# EAGLE design MOOG_AC2690_toSPI_Commutator_Board (EAGLE 8.3.2)
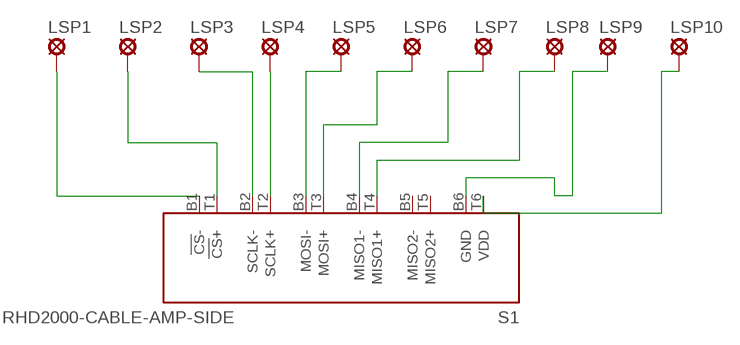
[diagram p0: schematic, sheet 1]

## Parts
LSP1  LSP11  [LSP11]
LSP2  LSP11  [LSP11]
LSP3  LSP11  [LSP11]
LSP4  LSP11  [LSP11]
LSP5  LSP11  [LSP11]
LSP6  LSP11  [LSP11]
LSP7  LSP11  [LSP11]
LSP8  LSP11  [LSP11]
LSP9  LSP11  [LSP11]
LSP10  LSP11  [LSP11]
S1  RHD2000-CABLE-AMP-SIDE  [OMNETICS_PZN-12-AA]

## Nets
N$12: LSP1.MP S1.B1(!CS!-)
N$13: LSP2.MP S1.T1(!CS!+)
N$14: LSP3.MP S1.B2(SCLK-)
N$15: LSP4.MP S1.T2(SCLK+)
N$16: LSP5.MP S1.B3(MOSI-)
N$17: LSP6.MP S1.T3(MOSI+)
N$18: LSP7.MP S1.B4(MISO1-)
N$19: LSP8.MP S1.T4(MISO1+)
N$20: LSP9.MP S1.B6(GND)
N$21: LSP10.MP S1.T6(VDD)
Unconnected: S1.B5(MISO2-) S1.T5(MISO2+)

## Library data of the parts
LSP1-LSP10 = solpad:LSP11: SOLDER PAD drill 1.1 mm
S1 = RHD2000:RHD2000-CABLE-AMP-SIDE: Omnetics A79623 PZN-12-AA connector for SPI interface (amplifier side)

## Board
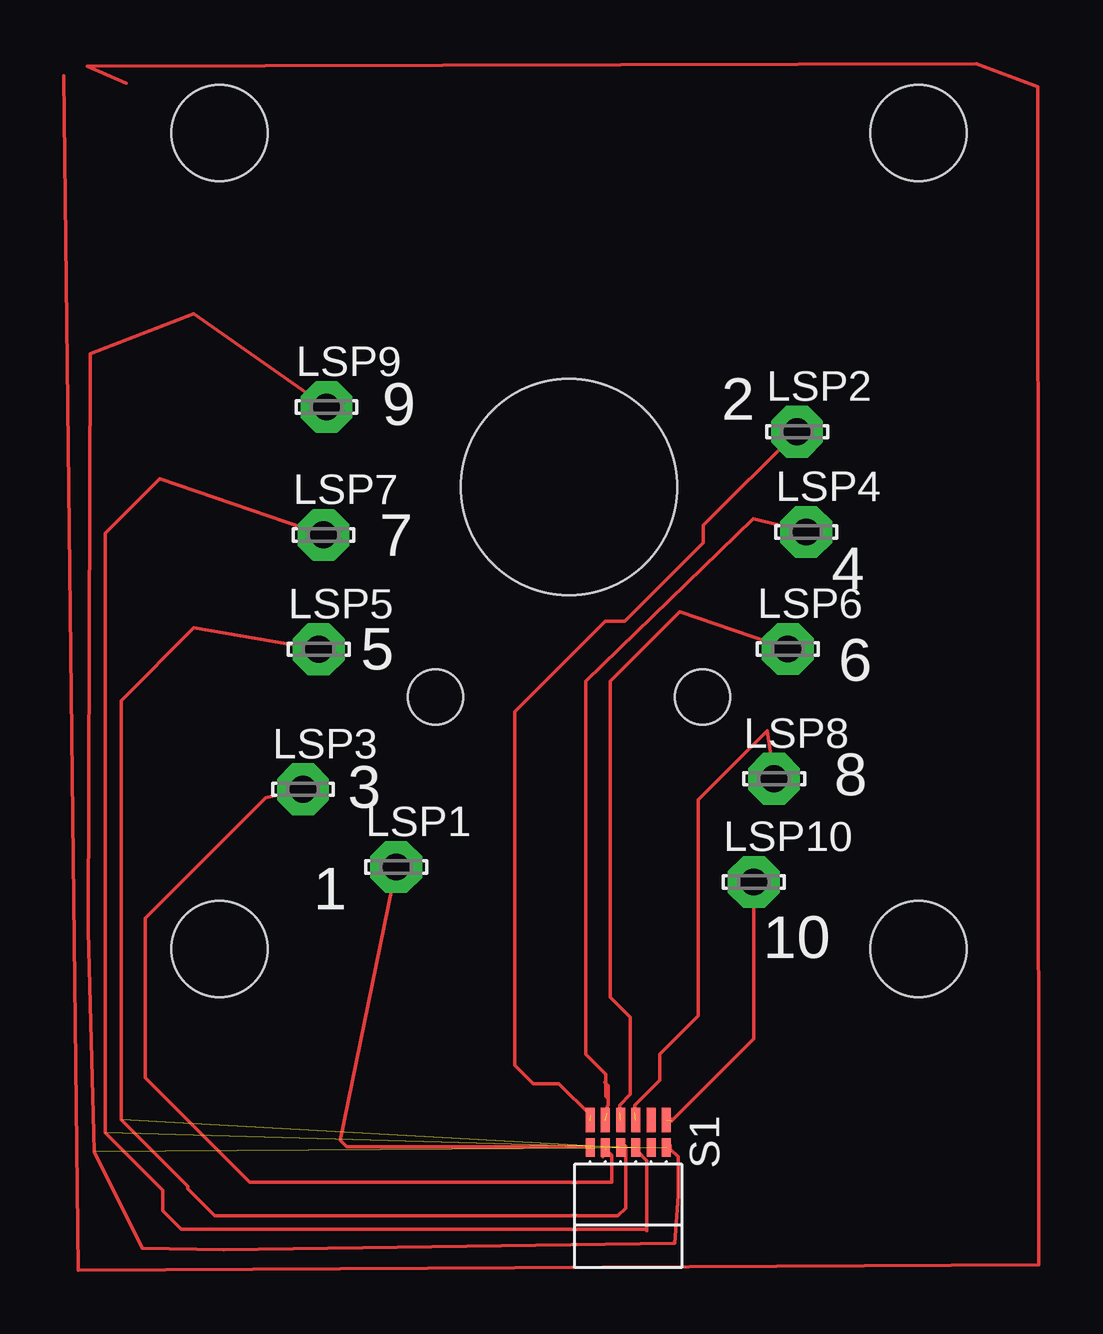
[diagram p1: board, top side]

No outline drawn. Coordinates in mm, seen from the top.
Copper layers (1*16): Top 0.035mm / dielectric 1.5mm / Bottom 0.035mm
Design rules "default": minimum track width 6mil, minimum drill 0.35mm, track to track 6mil, track to pad 6mil, pad to pad 6mil, via to via 6mil, smd to smd 6mil, copper to edge 40mil, drill to drill 6mil, minimum pad ring 10mil, minimum via ring 8mil, stop-mask expansion 4mil, vias tented up to drill 0mil, thermal gap 10mil
Holes 9 mm at 80,30
Holes 2.29 mm at 74.44,21.25 85.56,21.25
Holes 4 mm at 65.44,10.75 94.56,10.75 65.44,44.75 94.56,44.75

### Footprints (pad centres in the part's own frame; a part is rotated, then mirrored left to right if it is on the bottom)
LSP11 = drill 1.118 pad 2.159 octagon: MP 0,0
OMNETICS_PZN-12-AA = smd 0.381 x 0.762: B1 1.587,-1.016; B2 0.953,-1.016; B3 0.318,-1.016; B4 -0.318,-1.016; B5 -0.953,-1.016; B6 -1.587,-1.016 | smd 0.381 x 1.016: T1 1.587,-2.159; T2 0.953,-2.159; T3 0.318,-2.159; T4 -0.318,-2.159; T5 -0.953,-2.159; T6 -1.587,-2.159

### Placement (x,y rotation side)
LSP1  72.8,14.16 0 top
LSP2  89.5,32.3 0 top
LSP3  68.92,17.4 0 top
LSP4  89.88,28.12 0 top
LSP5  69.57,23.23 0 top
LSP6  89.12,23.25 0 top
LSP7  69.77,28 0 top
LSP8  88.54,17.84 0 top
LSP9  69.89,33.33 0 top
LSP10  87.7,13.54 0 top
S1  82.47,1.46 180 top

### Tracks (layer width: path | path; a pad name or v marks a point on that pad's centre or on a via)
N$12  (1 unrouted)
  Top 0.152: LSP1.MP 70.47,2.78 70.74,2.51 80.72,2.51
N$13  (1 unrouted)
  Top 0.152: LSP2.MP 85.59,28.4 85.59,27.68 82.32,24.41 81.52,24.41 77.74,20.63 77.74,5.91 78.51,5.14 79.58,5.14 80.9,3.83
N$14  (1 unrouted)
  Top 0.152: 81.41,2.08 81.55,2.22 81.55,2.38 81.78,2.15 81.78,1.03 66.7,1.03 62.35,5.38 62.35,12.03 62.65,12.34 | 62.65,12.34 64.16,13.84 67.36,17.05 LSP3.MP | 62.65,12.34
N$15  (1 unrouted)
  Top 0.152: 81.49,5.2 81.64,5.05 81.64,4.5 | 81.64,4.5 81.64,4.24 81.6,4.2 81.6,3.9 | LSP4.MP 87.68,28.68 80.69,21.91 80.69,6.36 81.53,5.53 81.53,4.61 81.64,4.5
N$16  (1 unrouted)
  Top 0.152: LSP5.MP 64.37,24.12 61.34,21.09 61.34,3.64 64.12,0.86 64.12,0.75 65.24,-0.38 82.03,-0.38 82.36,-0.05 82.36,2.54
N$17  (1 unrouted)
  Top 0.152: LSP6.MP 84.61,24.8 81.72,21.91 81.72,8.74 82.55,7.9 82.55,4.69 82.1,4.24 82.1,3.93
N$18  (1 unrouted)
  Top 0.152: LSP7.MP 62.95,30.33 60.68,28.07 60.68,3.08 63.07,0.69 63.07,-0.15 63.84,-0.93 83.17,-0.93 83.25,-1 83.25,1.93 82.86,2.31 82.86,2.67
N$19  (1 unrouted)
  Top 0.152: LSP8.MP 88.25,19.84 85.38,16.96 85.38,7.97 83.77,6.36 83.77,5.27 82.75,4.24 82.75,3.93
N$20  (1 unrouted)
  Top 0.152: LSP9.MP 64.35,37.22 60.05,35.54 59.96,11.51 60.22,2.31 62.22,-1.72 65.61,-1.78 84.41,-1.52 84.55,0.48 84.55,2.09 84.23,2.41 84.23,2.57
N$21  (1 unrouted)
  Top 0.152: LSP10.MP 87.7,7.01 84.29,3.6 84.29,3.65
S$1
  Top 0.152: 58.94,47.12 59.55,-2.63 99.58,-2.42 99.53,46.67 96.97,47.64 59.93,47.52 61.55,46.81

### Text on the board
tNames: 9 | 2 | 7 | 4 | 5 | 6 | 3 | 8 | 1 | 10